# EasyEDA Pro project ProDocument_Upper_ESP32_2024-12-26.epro

# Schematic Upper_ESP32
Create Date: 2024-12-10; Page Name: P1; Project Name: Kame Quadrapot; Schematic Name: Upper_ESP32; Update Date: 2024-12-20; Company: Personal; Drawn: San Thit Aung; Page Size: A3; Part Number: PCB002; Reviewed: San Thit Aung; Version: V0.1
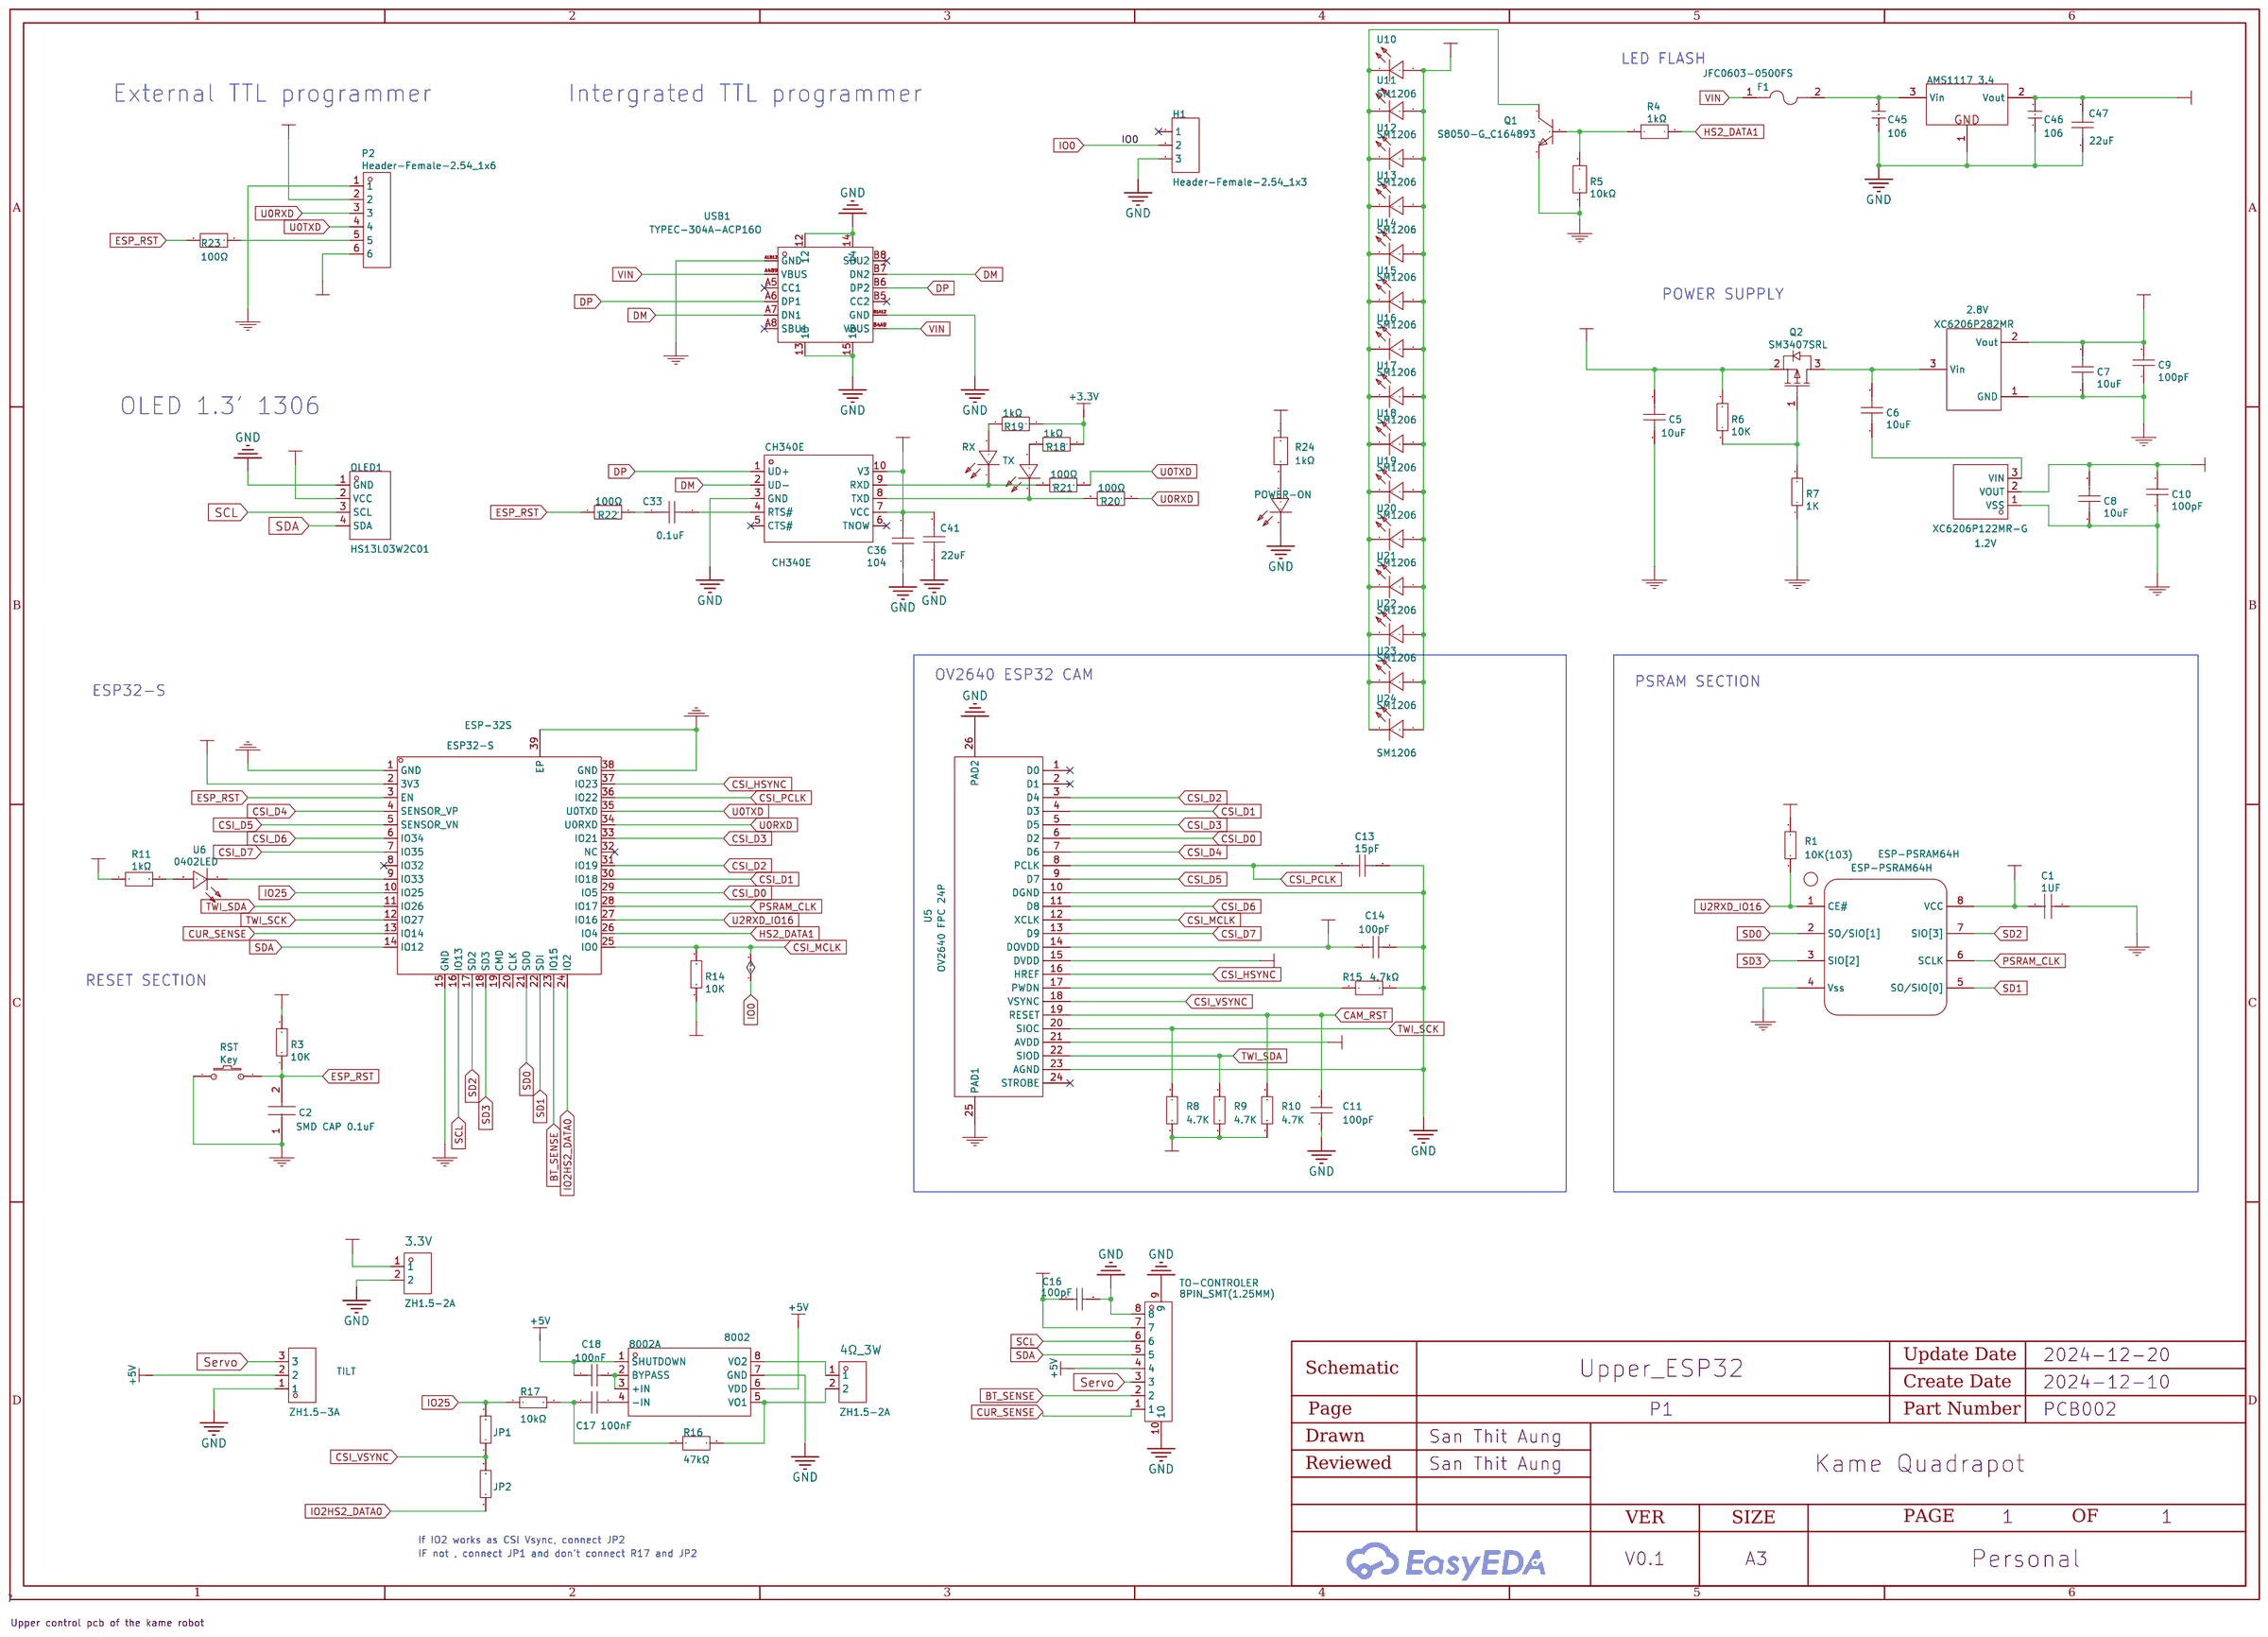
[diagram p0: schematic sheet]

## Parts
1.2V  XC6206P122MR-G  [SOT-23-3_L2.9-W1.6-P1.90-LS2.8-BR]
2.8V  XC6206P282MR  [SOT-23-3_L2.9-W1.6-P1.90-LS2.8-BR]
3.3V  ZH1.5-2A  [CONN-TH_ZH-1.5-2A]
4Ω_3W  ZH1.5-2A  [CONN-TH_ZH-1.5-2A]
8002A  8002  [SOP-8_L4.9-W3.9-P1.27-LS6.0-BL]
AMS1117 3.4  AMS1117-3.3  [TO-252-3_L6.6-W6.1-P4.58-LS10.1-BR]
C1  1UF  [0402]
C2  SMD CAP 0.1uF  [CAPC2012X94N]
C5  10uF  [C0805]
C6  10uF  [C0805]
C7  10uF  [C0805]
C8  10uF  [C0805]
C9  100pF  [C0402]
C10  100pF  [C0402]
C11  100pF  [C0402]
C13  15pF  [C0402]
C14  100pF  [C0402]
C16  100pF  [C0402]
C17  100nF  [C0603]
C18  100nF  [C0603]
C33  0.1uF  [C0603]
C36  104  [C0603]
C41  22uF  [C1206]
C45  106  [C0805]
C46  106  [C0805]
C47  22uF  [C1206]
CH340E  CH340E  [MSOP-10_L3.0-W3.0-P0.50-LS5.0-BL]
ESP-32S  ESP32-S  [WIRELM-SMD_ESP32-S-NO_CMD_CLK]
ESP-PSRAM64H  ESP-PSRAM64H  [SOP8_150MIL_JX]
F1  JFC0603-0500FS  [F0603]
H1  Header-Female-2.54_1x3  [HDR-3X1/2.54]
JP1  10kΩ  [R0603]
JP2  10kΩ  [R0603]
OLED1  HS13L03W2C01  [1.3'' 4pin oled SH1106]
P2  Header-Female-2.54_1x6  [HDR-TH_6P-P2.54-V-F]
POWER-ON  Green  [LED0603-RD_GREEN]
Q1  S8050-G_C164893  [SOT-23-3_L2.9-W1.3-P1.90-LS2.4-BR]
Q2  SM3407SRL  [SOT-23-3_L2.9-W1.3-P1.90-LS2.4-BR]
R1  10K(103)  [0603]
R3  10K  [0201]
R4  1kΩ  [R0402]
R5  10kΩ  [R0402]
R6  10K  [R0402]
R7  1K  [R0603]
R8  4.7K  [R0402]
R9  4.7K  [R0402]
R10  4.7K  [R0402]
R11  1kΩ  [R0402]
R14  10K  [R0402]
R15  4.7kΩ  [R0402]
R16  47kΩ  [R0603]
R17  10kΩ  [R0603]
R18  1kΩ  [R0603]
R19  1kΩ  [R0603]
R20  100Ω  [R0603]
R21  100Ω  [R0603]
R22  100Ω  [R0603]
R23  100Ω  [R0603]
R24  1kΩ  [R0603]
RST  Key  [KEY]
RX  Green  [LED0603-RD_GREEN]
TILT  ZH1.5-3A  [CONN-TH_ZH1.5-3A_C2829733]
TO-CONTROLER  8PIN_SMT(1.25MM)  [CONN-SMD_8PIN_SMT-P1.25]
TX  LedGreen_0603  [LED0603-RD_GREEN]
U5  OV2640 FPC 24P  [OV2640 FPC 24P]
U6  0402LED  [LED0402-RD]
U10  SM1206  [LED1206-RD]
U11  SM1206  [LED1206-RD]
U12  SM1206  [LED1206-RD]
U13  SM1206  [LED1206-RD]
U14  SM1206  [LED1206-RD]
U15  SM1206  [LED1206-RD]
U16  SM1206  [LED1206-RD]
U17  SM1206  [LED1206-RD]
U18  SM1206  [LED1206-RD]
U19  SM1206  [LED1206-RD]
U20  SM1206  [LED1206-RD]
U21  SM1206  [LED1206-RD]
U22  SM1206  [LED1206-RD]
U23  SM1206  [LED1206-RD]
U24  SM1206  [LED1206-RD]
USB1  TYPEC-304A-ACP16O  [USB-SMD_TYPEC-304A-ACP16O]

## Library data of the parts
1.2V = XC6206P122MR-G: Supplier: LCSC; Supplier Part: C424699; Manufacturer: Torex Semicon; JLCPCB Part Class: Extend; JLCPCB SMD: Yes; SMT Type: Extend; spicePre: U
2.8V = XC6206P282MR: Supplier: LCSC; Manufacturer: TOREX; image: //image.lceda.cn/szlcsc/C14255.jpg; Supplier Part: C14255; JLCPCB Part Class: Extend; JLCPCB SMD: Yes; SMT Type: Extend; spicePre: U
3.3V 4Ω_3W = ZH1.5-2A_C722910: Pins Structure:1x2P Pitch:1.5mm Mounting Style:Straight Reference Series:ZH Number of Pins:2P Number of Rows:1 Number of PINs Per Row:2 Row Spacing:- Current Rating (Max):1A Operating Temperature Range:-25℃~+85℃ Operating Temperature Range:-25℃~+85℃; LCSC Part Name: 1x2P 间距:1.5mm 直插 系列:ZH; Supplier Part: C722910; Manufacturer: CAX(创都); Supplier Footprint: 插件,P=1.5mm; JLCPCB Part Class: Extended Part; Datasheet: https://atta.szlcsc.com/upload/public/pdf/source/20200902/C722910_3A606E9023366FB4B71ACF538A145687.pdf; Supplier: LCSC; Pins Structure: 1x2P; Pitch: 1.5mm; Mounting Style: Straight; Reference Series: ZH; Number of Pins: 2P; Number of Rows: 1; Number of PINs Per Row: 2; Current Rating (Max): 1A; Operating Temperature Range: -25℃~+85℃
8002A = 8002: LCSC Part Name: Aip8002; Supplier Part: C5139016; Manufacturer: I-CORE(中微爱芯); Supplier Footprint: SOP-8; JLCPCB Part Class: Extended Part; Datasheet: https://atta.szlcsc.com/upload/public/pdf/source/20220816/03501F7F7652C9F9E3FDDA0D1837E9DD.pdf; Supplier: LCSC
AMS1117 3.4 = AMS1117-5.0: ------ѹоƬ; BOM____: --ѹоƬ; __Ȩ____: Դ----; ѧϰ__Դ: www.ooocke.com; Origin Footprint 2: SOT223_L; Origin Footprint 3: SOT223_M; Origin Footprint 4: SOT223_N; Origin Footprint 5: SOT89_N; Origin Footprint 6: SOT89_M; Origin Footprint 1: SOT89_L; Design Item ID: AMS1117; Library Name: 1.3   - --Դ--оƬ
C1 = 1UF: Partnumber: CL05A105MP5NNNC; Manufacturer: Samsung Electro-Mechanics; Comment: =Value; spicePre: C
C2 = SMD CAP 0.1uF: spicePre: C
C5-C8 = 10uF: Supplier: LCSC; Manufacturer: FH; Manufacturer Part: 0805F106M160NT; Supplier Part: C90545; JLCPCB Part Class: Extend; JLCPCB SMD: Yes; SMT Type: Extend; spicePre: C
C9-C11 C14 C16 = 100pF: Supplier: LCSC; Manufacturer: FH; Manufacturer Part: 0402CG101J500NT; Supplier Part: C1546; JLCPCB Part Class: Basic; JLCPCB SMD: Yes; SMT Type: Basic; spicePre: C
C13 = 15pF: Supplier: LCSC; Supplier Part: C3903890; Manufacturer: TDK; Manufacturer Part: CGJ2B2C0G1H150J050BA; spicePre: C
C17 C18 = CT41G-0603-2X1-50V-0.1μF-K(N): Capacitance: Tolerance:±10% Tolerance:±10% Voltage Rated: Temperature Coefficient:; LCSC Part Name: 100nF ±10% 50V; Supplier Part: C125205; Manufacturer: TORCH(火炬); Supplier Footprint: 0603; JLCPCB Part Class: Extended Part; Datasheet: https://atta.szlcsc.com/upload/public/pdf/source/20171225/C150708_15141883600121203188.pdf; Supplier: LCSC; Tolerance: ±10%
C33 C36 = 1u: Manufacturer Part: ?
C41 C47 = 22uF: Supplier: LCSC; Supplier Part: C141046; Manufacturer: KEMET; Manufacturer Part: C1210C106M4PAC7800; JLCPCB Part Class: Extended Part
C45 C46 = 106: -޼-----Ƭ----; BOM____: -޼-----Ƭ----; __Ȩ____: Դ----; ѧϰ__Դ: www.ooocke.com; Origin Footprint 2: C 0201_L; Origin Footprint 3: C 0402_L; Origin Footprint 4: C 0603_L; Origin Footprint 5: C 1206_L; Origin Footprint 6: C 1210_L; Origin Footprint 7: C 1808_L; Origin Footprint 8: C 1812_L; Origin Footprint 9: C 1825_L; Origin Footprint 10: C 2225_L; Origin Footprint 11: C 0201_M; Origin Footprint 12: C 0402_M; Origin Footprint 13: C 0603_M; Origin Footprint 14: C 0805_M; Origin Footprint 15: C 1206_M; Origin Footprint 16: C 1210_M; Origin Footprint 17: C 1808_M; Origin Footprint 18: C 1812_M; Origin Footprint 19: C 1825_M; Origin Footprint 20: C 2225_M; Origin Footprint 1: C 0805_L; Design Item ID: C; Library Name: 3.1   - -------------
CH340E = CH340E: Applications Function:Transceiver Protocol: Supply Voltage:3.3V；5V Supply Voltage:3.3V；5V Data Rate:2Mbps; LCSC Part Name: USB转串口芯片CH340; Supplier Part: C99652; Manufacturer: WCH(南京沁恒); Supplier Footprint: MSOP-10; JLCPCB Part Class: Extended Part; Datasheet: https://atta.szlcsc.com/upload/public/pdf/source/20240313/4FD4567B6A986AE079C4960D6CEBDDB5.pdf; Supplier: LCSC; Applications Function: Transceiver; Supply Voltage: 3.3V；5V; Data Rate: 2Mbps
ESP-32S = ESP32-S: Supplier: LCSC; Supplier Part: C277944; Manufacturer: Ai-Thinker; spicePre: U
ESP-PSRAM64H = ESP-PSRAM64H: Manufacturer: Espressif; Manufacturer Part: PSRAM64H; link: https://www.espressif.com/sites/default/files/documentation/esp-psram64_esp-psram64h_datasheet_en.pdf; spicePre: U
F1 = JFC0603-0500FS: Type:SMD Fuse Current Rating:500mA Voltage Rating  (AC):32V Voltage Rating (DC):32V Operating Temperature:-55℃~+125℃ Operating Temperature:-55℃~+125℃ Breaking Capacity:50A; LCSC Part Name: 贴片式保险丝; Supplier Part: C136327; Manufacturer: JDTfuse(集电通); Supplier Footprint: 0603; JLCPCB Part Class: Extended Part; Datasheet: https://atta.szlcsc.com/upload/public/pdf/source/20230515/811EFBDB78EA9425F730277E38B1B60D.pdf; Supplier: LCSC; Type: SMD Fuse; Current Rating: 500mA; Voltage Rating  (AC): 32V; Voltage Rating (DC): 32V; Operating Temperature: -55℃~+125℃; Breaking Capacity: 50A
H1 = Header-Female-2.54_1x3: Supplier Part: C50950; Supplier: LCSC; Manufacturer: BOOMELE; Manufacturer Part: 2.54mm 1*3p Female header
JP1 JP2 R17 = RMC060310KFN: Resistance: Tolerance:±1% Tolerance:±1% Power(Watts):; LCSC Part Name: 10kΩ ±1% 100mW; Supplier Part: C269701; Manufacturer: Tyohm(幸亚电阻); Supplier Footprint: 0603; JLCPCB Part Class: Extended Part; Datasheet: https://atta.szlcsc.com/upload/public/pdf/source/20190115/C325956_D27151D492FFB3C9AB4A6F14FE01F30A.pdf; Supplier: LCSC; Tolerance: ±1%
OLED1 = HS13L03W2C01: Main Control Chip:SH1106 Interface Type:I2C Size:1.3 Operating Temperature:-40℃~+70℃ Operating Temperature:-40℃~+70℃; LCSC Part Name: 1.3'1.3寸 128*64 OLED显示屏 I2C通讯 SH1106 白光; Supplier Part: C7465997; Manufacturer: HS(汉昇); JLCPCB Part Class: Extended Part; Datasheet: https://atta.szlcsc.com/upload/public/pdf/source/20230720/8731A47396DED074CDCD72E9ACEFB46F.pdf; Supplier: LCSC; Main Control Chip: SH1106; Interface Type: I2C; Size: 1.3; Operating Temperature: -40℃~+70℃
P2 = Header-Female-2.54_1x6: Supplier: LCSC; Manufacturer: BOOMELE(博穆精密); Manufacturer Part: 2.54-1*6P母; Supplier Part: C40877; JLCPCB Part Class: Extended Part; spicePre: P
POWER-ON RX TX = LedGreen_0603: Supplier: Mouser
Q1 = S8050-G_C164893: Supplier: LCSC; Supplier Part: C164893; Manufacturer: Changjiang Electronics Tech (CJ); Manufacturer Part: S8050-G; JLCPCB Part Class: Extend; JLCPCB SMD: Yes; SMT Type: Extend; spicePre: Q
Q2 = SM3407SRL: Supplier: LCSC; Supplier Part: C235545; Manufacturer: SPS; JLCPCB Part Class: Extend; JLCPCB SMD: Yes; SMT Type: Extend; spicePre: Q
R1 = 10K(103): Supplier Part: C99198; Supplier: LCSC; Manufacturer: YAGEO; Manufacturer Part: RC0603JR-0710KL; spicePre: R
R3 = 10K: Supplier: Digi-Key; Manufacturer: YAGEO; Manufacturer Part: RC0201JR-0710KL; Supplier Part: 311-10KNCT-ND; sourceId: Yke82kCUc; spicePre: R
R4 R11 = 1kΩ: Supplier: LCSC; Supplier Part: C2961360; Manufacturer: FH(风华); Manufacturer Part: TC02G1001FT; JLCPCB Part Class: Extended Part; spicePre: U
R5 = 10kΩ: Supplier: LCSC; Supplier Part: C5119777; Manufacturer: RALEC(旺诠); Manufacturer Part: RAT021002FTH; JLCPCB Part Class: Extended Part; spicePre: U
R6 R14 = 10K: Supplier: LCSC; Manufacturer: UniOhm; Manufacturer Part: 0402WGF1002TCE; Supplier Part: C25744; JLCPCB Part Class: Basic; JLCPCB SMD: Yes; SMT Type: Basic; spicePre: R
R7 = 1K: Supplier: LCSC; Manufacturer: UniOhm; Manufacturer Part: 0603WAF1001T5E; Supplier Part: C21190; JLCPCB Part Class: Basic; JLCPCB SMD: Yes; SMT Type: Basic; spicePre: R
R8-R10 = 4.7K: Supplier: LCSC; Manufacturer: UniOhm; Manufacturer Part: 0402WGF4701TCE; Supplier Part: C25900; JLCPCB Part Class: Basic; JLCPCB SMD: Yes; SMT Type: Basic; spicePre: R
R15 = 4.7kΩ: Supplier: LCSC; Supplier Part: C2906941; Manufacturer: FOJAN(富捷); Manufacturer Part: FRC0402J472 TS; JLCPCB Part Class: Extended Part; spicePre: U
R16 R18-R24 = SCR0603F8R06: Type:Thick Film Resistors Resistance: Tolerance:±1% Tolerance:±1% Power(Watts): Overload Voltage (Max): Operating Temperature Range:-55℃~+155℃ Operating Temperature Range:-55℃~+155℃; LCSC Part Name: 厚膜电阻 8.06Ω ±1% 100mW; Supplier Part: C3016465; Manufacturer: VO(翔胜); Supplier Footprint: 0603; JLCPCB Part Class: Extended Part; Datasheet: https://atta.szlcsc.com/upload/public/pdf/source/20220513/247AF9639BA21CF93567DC289CCC6A22.pdf; Supplier: LCSC; Type: Thick Film Resistors; Tolerance: ±1%; Operating Temperature Range: -55℃~+155℃
RST = Key: spicePre: U
TILT = ZH1.5-3A: Pins Structure:1x3P Pitch:1.5mm Mounting Style:Direct Insert Reference Series:ZH Number of Pins:3P Number of Rows:1 Number of PINs Per Row:3 Current Rating (Max):1A Contact Material:Brass Contact Plating:Tin Operating Temperature Range:-25℃~+85℃ Operating; LCSC Part Name: 1x3P 间距:1.5mm 直插 系列:ZH; Supplier Part: C2829733; Manufacturer: FG(富港); Supplier Footprint: 插件,P=1.5mm; JLCPCB Part Class: Extended Part; Datasheet: https://atta.szlcsc.com/upload/public/pdf/source/20210425/C2829732_F26530E371F6662D5811C22FF273BDDC.pdf; Supplier: LCSC; Pins Structure: 1x3P; Pitch: 1.5mm; Mounting Style: Direct Insert; Reference Series: ZH; Number of Pins: 3P; Number of Rows: 1; Number of PINs Per Row: 3; Current Rating (Max): 1A; Contact Material: Brass; Contact Plating: Tin; Operating Temperature Range: -25℃~+85℃; Rated Voltage (Max): 100V
TO-CONTROLER = 8PIN_SMT(1.25MM): Supplier Part: C9900003224; Supplier Footprint: CON-SMD-8PIN-P1.25mm; JLCPCB Part Class: Extended Part; Supplier: LCSC
U5 = OV2640 FPC 24P: Supplier: LCSC; spicePre: U
U6 = 0402LED: Supplier: LCSC; Supplier Part: C9900023982; Manufacturer: null; JLCPCB Part Class: Extended Part; spicePre: U
U10-U24 = SM1206: Supplier Part: C9900019107; Supplier Footprint: LED-SMD1206; JLCPCB Part Class: Extended Part; Supplier: LCSC
USB1 = TYPEC-304A-ACP16O: Supplier: LCSC; Supplier Part: C2909610; Manufacturer: XUNPU(讯普); JLCPCB Part Class: Extended Part

## Nets
+3.3V: 3.3V.1 AMS1117 3.4.2(Vout) C1.1 C5.2 C14.1 C16.1 C36.2 C41.2 C46.2 C47.2 CH340E.7(VCC) CH340E.10(V3) ESP-32S.2(3V3) ESP-PSRAM64H.8(VCC) OLED1.2(VCC) P2.6 Q2.2(S) R1.2 R3.2 R6.2 R8.1 R9.1 R10.1 R11.1 R14.1 R18.1 R19.1 R24.1 TO-CONTROLER.7 U5.14(DOVDD) U10.2(+) U11.2(+) U12.2(+) U13.2(+) U14.2(+) U15.2(+) U16.2(+) U17.2(+) U18.2(+) U19.2(+) U20.2(+) U21.2(+) U22.2(+) U23.2(+) U24.2(+)
+5V: 8002A.1(SHUTDOWN) 8002A.6(VDD) C18.1 P2.2 TILT.2 TO-CONTROLER.4
GND: 1.2V.1(VSS) 2.8V.1(GND) 3.3V.2 8002A.7(GND) AMS1117 3.4.1(GND) C1.2 C2.1 C5.1 C7.1 C8.1 C9.1 C10.1 C11.1 C13.2 C14.2 C16.2 C36.1 C41.1 C45.1 C46.1 C47.1 CH340E.3(GND) ESP-32S.1(GND) ESP-32S.15(GND) ESP-32S.38(GND) ESP-32S.39(EP) ESP-PSRAM64H.4(Vss) H1.3 OLED1.1(GND) P2.1 POWER-ON.1(K) Q1.2(E) R5.1 R7.1 R15.2 RST.1 TILT.1 TO-CONTROLER.8 TO-CONTROLER.9 TO-CONTROLER.10 U5.10(DGND) U5.23(AGND) U5.25(PAD1) U5.26(PAD2) USB1.12 USB1.13 USB1.14 USB1.15 USB1.A1B12(GND) USB1.B1A12(GND)
VIN: F1.1 USB1.A4B9(VBUS) USB1.B4A9(VBUS)
BT_SENSE: ESP-32S.23(IO15) TO-CONTROLER.2
CAM_RST: C11.2 R10.2 U5.19(RESET)
CSI_1.2V: 1.2V.2(VOUT) C8.2 C10.2 U5.15(DVDD)
CSI_2.8V: 2.8V.2(Vout) C7.2 C9.2 U5.21(AVDD)
CSI_D0: ESP-32S.29(IO5) U5.6(D2)
CSI_D1: ESP-32S.30(IO18) U5.4(D3)
CSI_D2: ESP-32S.31(IO19) U5.3(D4)
CSI_D3: ESP-32S.33(IO21) U5.5(D5)
CSI_D4: ESP-32S.4(SENSOR_VP) U5.7(D6)
CSI_D5: ESP-32S.5(SENSOR_VN) U5.9(D7)
CSI_D6: ESP-32S.6(IO34) U5.11(D8)
CSI_D7: ESP-32S.7(IO35) U5.13(D9)
CSI_HSYNC: ESP-32S.37(IO23) U5.16(HREF)
CSI_MCLK: ESP-32S.25(IO0) H1.2 R14.2 U5.12(XCLK)
CSI_PCLK: C13.1 ESP-32S.36(IO22) U5.8(PCLK)
CSI_VSYNC: JP1.1 JP2.2 U5.18(VSYNC)
CUR_SENSE: ESP-32S.13(IO14) TO-CONTROLER.1
DM: CH340E.2(UD-) USB1.A7(DN1) USB1.B7(DN2)
DP: CH340E.1(UD+) USB1.A6(DP1) USB1.B6(DP2)
ESP_RST: C2.2 ESP-32S.3(EN) R3.1 R22.2 R23.2 RST.2
HS2_DATA1: ESP-32S.26(IO4) R4.2
IO2HS2_DATA0: ESP-32S.24(IO2) JP2.1
IO25: ESP-32S.10(IO25) JP1.2 R17.1
PSRAM_CLK: ESP-32S.28(IO17) ESP-PSRAM64H.6(SCLK)
SCL: ESP-32S.16(IO13) OLED1.3(SCL) TO-CONTROLER.6
SD0: ESP-32S.21(SDO) ESP-PSRAM64H.2(SO/SIO[1])
SD1: ESP-32S.22(SDI) ESP-PSRAM64H.5(SO/SIO[0])
SD2: ESP-32S.17(SD2) ESP-PSRAM64H.7(SIO[3])
SD3: ESP-32S.18(SD3) ESP-PSRAM64H.3(SIO[2])
SDA: ESP-32S.14(IO12) OLED1.4(SDA) TO-CONTROLER.5
Servo: TILT.3 TO-CONTROLER.3
TWI_SCK: ESP-32S.12(IO27) R8.2 U5.20(SIOC)
TWI_SDA: ESP-32S.11(IO26) R9.2 U5.22(SIOD)
U0RXD: ESP-32S.34(U0RXD) P2.3 R20.1
U0TXD: ESP-32S.35(U0TXD) P2.4 R21.1
U2RXD_IO16: ESP-32S.27(IO16) ESP-PSRAM64H.1(CE#) R1.1
$1N1366: Q1.1(B) R4.1 R5.2
$1N1371: Q2.1(G) R6.1 R7.2
$1N1376: 1.2V.3(VIN) C6.1
$1N1377: 2.8V.3(Vin) C6.2 Q2.3(D)
$1N1387: R11.2 U6.2(+)
$1N2699: R15.1 U5.17(PWDN)
$1N3848: ESP-32S.9(IO33) U6.1(-)
$1N6631: 8002A.4(-IN) C17.2
$1N6705: 8002A.2(BYPASS) 8002A.3(+IN) C18.2
$1N6802: 4Ω_3W.1 8002A.8(VO2)
$1N6814: 4Ω_3W.2 8002A.5(VO1) R16.2
$1N6899: C17.1 R16.1 R17.2
$1N8468: R19.2 RX.2(A)
$1N8470: R18.2 TX.2(A)
$1N8560: CH340E.8(TXD) R20.2 TX.1(K)
$1N8606: CH340E.9(RXD) R21.2 RX.1(K)
$1N8778: P2.5 R23.1
$1N8842: C33.2 CH340E.4(RTS#)
$1N8845: C33.1 R22.1
$1N9016: POWER-ON.2(A) R24.2
$1N9952: Q1.3(C) U10.1(-) U11.1(-) U12.1(-) U13.1(-) U14.1(-) U15.1(-) U16.1(-) U17.1(-) U18.1(-) U19.1(-) U20.1(-) U21.1(-) U22.1(-) U23.1(-) U24.1(-)
$1N12496: AMS1117 3.4.3(Vin) C45.2 F1.2

Not connected (* = marked no-connect by the designer): CH340E 5(CTS#)* 6(TNOW)*; ESP-32S 8(IO32)* 19(CMD) 20(CLK) 32(NC)*; H1 1*; U5 1(D0)* 2(D1)* 24(STROBE)*; USB1 A5(CC1)* A8(SBU1)* B5(CC2)* B8(SBU2)*

## Notes on the sheet
- LED FLASH
- External TTL programmer
- Intergrated TTL programmer
- POWER SUPPLY
- OLED 1.3' 1306
- OV2640 ESP32 CAM
- PSRAM SECTION
- ESP32-S
- RESET SECTION
- If IO2 works as CSI Vsync, connect JP2
- IF not , connect JP1 and don't connect R17 and JP2

# Board Upper_ESP32
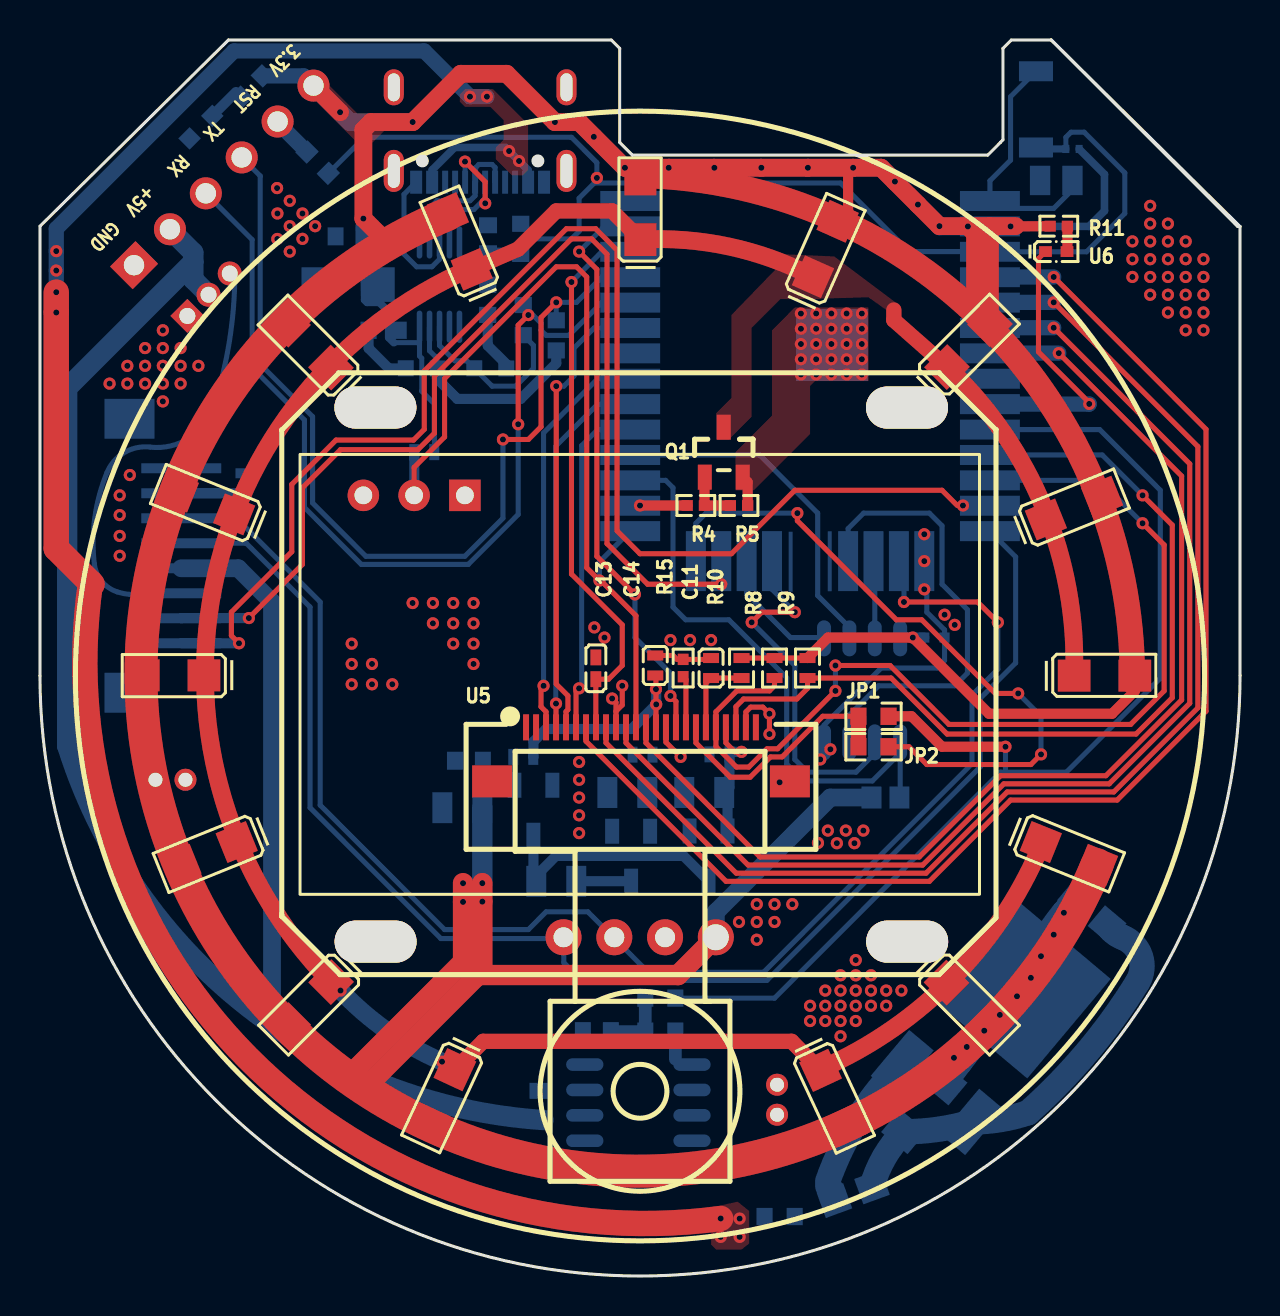
[diagram p1: board, top side]
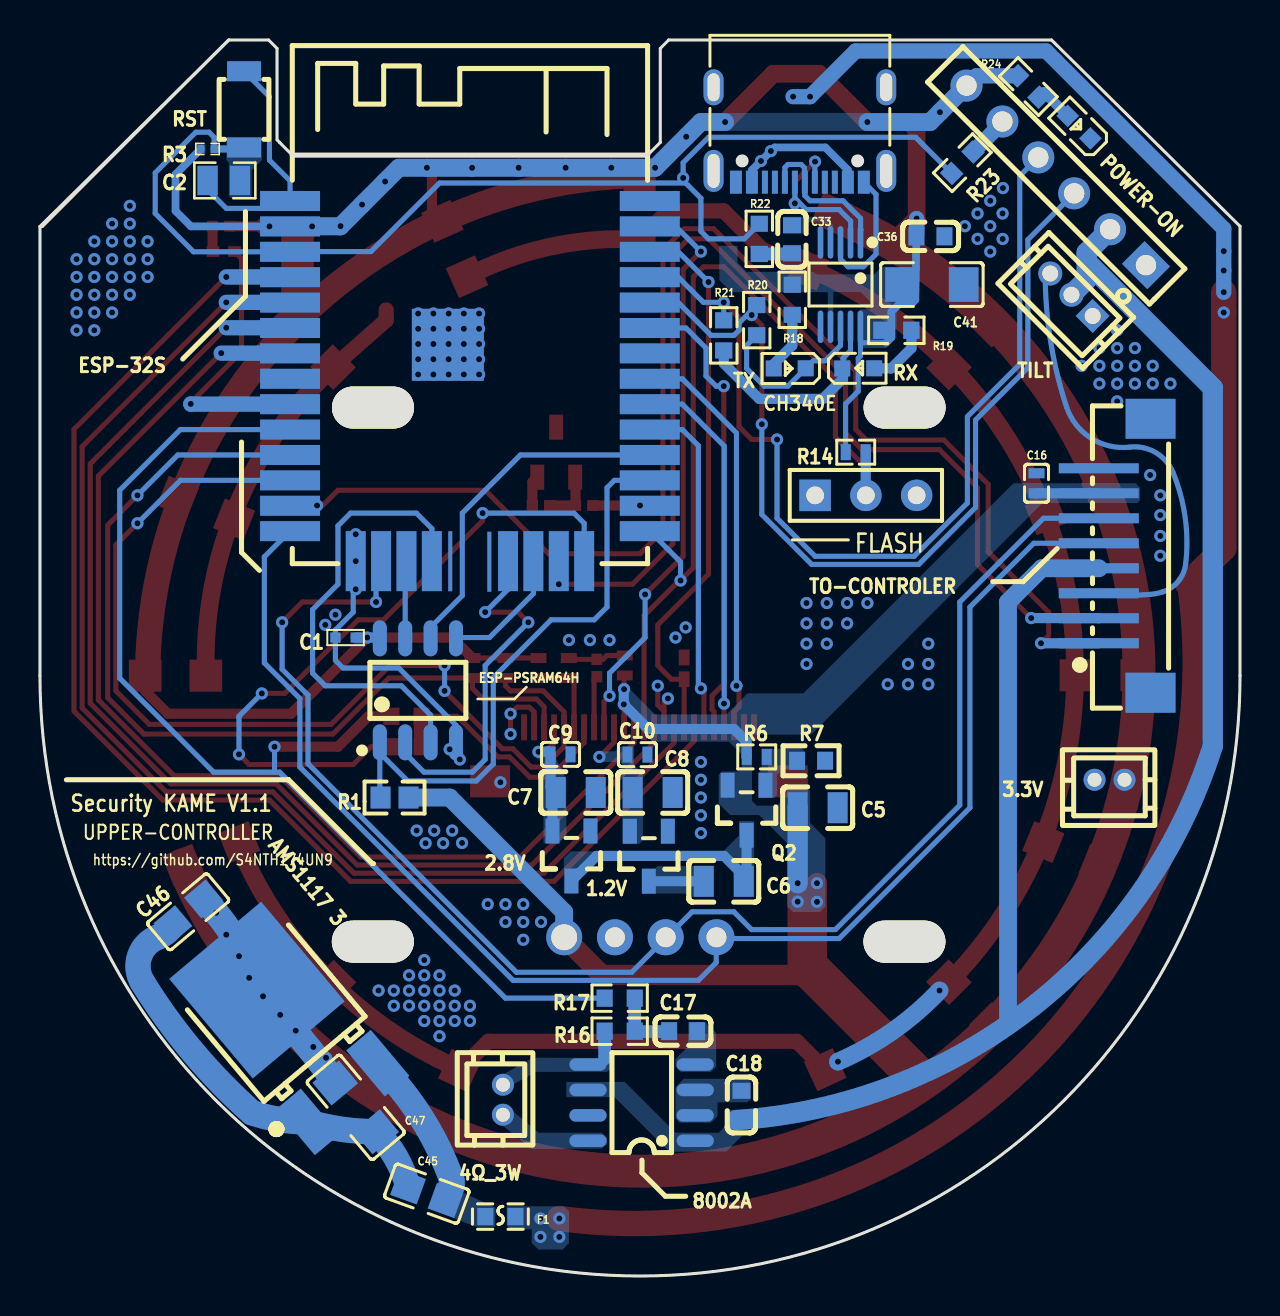
[diagram p2: board, bottom side, seen from below]

Outline 60.05 x 61.81 mm; copper layers: Top Layer, Bottom Layer. Coordinates in mm from the lower left corner of the outline.
Outline path: 50.6,61.81 48.61,61.81 48.19,61.39 48.19,56.82 48.06,56.7 48.06,56.69 47.42,56.06 29.64,56.06 29.01,56.69 29.01,61.39 28.59,61.81 9.43,61.81 0,52.5 0,30.02 arc(30.02,0) 60.05,30.02 60.05,52.49 ; 50.6,61.81 59.93,52.49 60.05,52.49 ; 50.6,61.81 60.05,52.49
Stack: Top Layer 0.035mm / Dielectric1 1.51mm FR4 er 4.5 / Bottom Layer 0.035mm

## Design rules (mm)
template: User Custom Config
spacing safeClearance (default): track to track 0.152, other pairs 0 to 0.152
track width trackWidth (default): min 0.003, default 0.003, max 2.54
differential pair differentialPair (default): width min 0.127, default 0.254, max 2.54; gap min 0.152, default 0.152
via viaSize (default): diameter min 0, default 0, max 2.601; hole min 0, default 0, max 1.999
net GND uses copperRegion1

## Placement (name value [footprint] x y rotation side)
1.2V  XC6206P122MR-G  [SOT-23-3_L2.9-W1.6-P1.90-LS2.8-BR]  29.58 20.99 90 bottom
2.8V  XC6206P282MR  [SOT-23-3_L2.9-W1.6-P1.90-LS2.8-BR]  33.45 21.01 90 bottom
3.3V  ZH1.5-2A  [CONN-TH_ZH-1.5-2A]  6.53 24.82 0 bottom
4Ω_3W  ZH1.5-2A  [CONN-TH_ZH-1.5-2A]  36.88 8.82 90 bottom
8002A  8002  [SOP-8_L4.9-W3.9-P1.27-LS6.0-BL]  29.94 8.67 90 bottom
AMS1117 3.4  AMS1117-3.3  [TO-252-3_L6.6-W6.1-P4.58-LS10.1-BR]  47.04 11.74 230 bottom
C1  1UF  [0402]  44.76 31.93 0 bottom
C2  SMD CAP 0.1uF  [CAPC2012X94N]  50.85 54.79 180 bottom
C5  10uF  [C0805]  21.13 23.42 0 bottom
C6  10uF  [C0805]  25.83 19.74 180 bottom
C7  10uF  [C0805]  33.24 24.18 0 bottom
C8  10uF  [C0805]  29.39 24.18 0 bottom
C9  100pF  [C0402]  34 26.09 0 bottom
C10  100pF  [C0402]  30.15 26.07 0 bottom
C11  100pF  [C0402]  33.58 30.41 270 top
C13  15pF  [C0402#2]  27.81 30.39 90 top
C14  100pF  [C0402]  30.79 30.53 90 top
C16  100pF  [C0402]  10.18 39.65 90 bottom
C17  100nF  [C0603]  27.87 12.24 180 bottom
C18  100nF  [C0603]  24.94 8.56 90 bottom
C33  0.1uF  [C0603]  22.42 51.85 90 bottom
C36  104  [C0603]  15.49 52 0 bottom
C41  22uF  [C1206]  15.42 49.58 0 bottom
C45  106  [C0805#2]  40.69 4.12 200 bottom
C46  106  [C0805#2]  52.63 18.21 140 bottom
C47  22uF  [C1206]  44.25 8.43 50 bottom
CH340E  CH340E  [MSOP-10_L3.0-W3.0-P0.50-LS5.0-BL]  19.99 49.58 0 bottom
ESP-32S  ESP32-S  [WIRELM-SMD_ESP32-S-NO_CMD_CLK]  38.53 44.76 180 bottom
ESP-PSRAM64H  ESP-PSRAM64H  [SOP8_150MIL_JX]  41.14 29.29 180 bottom
F1  JFC0603-0500FS  [F0603]  37.01 2.97 0 bottom
H1  Header-Female-2.54_1x3  [HDR-3X1/2.54]  16.18 39.04 180 bottom
JP1  10kΩ  [R0603]  41.71 27.99 0 top
JP2  10kΩ  [R0603]  41.71 26.47 180 top
OLED1  HS13L03W2C01  [1.3'' 4pin oled SH1106]  30.01 30.09 180 top
P2  Header-Female-2.54_1x6  [HDR-TH_6P-P2.54-V-F]  9.2 55.04 45 bottom
POWER-ON  Green  [LED0603-RD_GREEN]  8.05 57.46 45 bottom
Q1  S8050-G_C164893  [SOT-23-3_L2.9-W1.3-P1.90-LS2.4-BR]  34.22 41.2 270 top
Q2  SM3407SRL  [SOT-23-3_L2.9-W1.3-P1.90-LS2.4-BR]  24.69 23.29 90 bottom
R1  10K(103)  [0603]  43.11 23.93 180 bottom
R3  10K  [0201]  51.67 56.36 0 bottom
R4  1kΩ  [R0402]  32.82 38.53 180 top
R5  10kΩ  [R0402]  34.98 38.53 180 top
R6  10K  [R0402#2]  24.18 25.96 0 bottom
R7  1K  [R0603#2]  21.46 25.77 0 bottom
R8  4.7K  [R0402#2]  36.76 30.41 270 top
R9  4.7K  [R0402#2]  38.41 30.41 270 top
R10  4.7K  [R0402#2]  35.1 30.41 270 top
R11  1kΩ  [R0402]  50.98 52.5 0 top
R14  10K  [R0402#2]  19.23 41.2 180 bottom
R15  4.7kΩ  [R0402]  32.18 30.41 90 top
R16  47kΩ  [R0603]  31.04 12.24 0 bottom
R17  10kΩ  [R0603]  31.04 13.9 180 bottom
R18  1kΩ  [R0603]  22.4 48.82 270 bottom
R19  1kΩ  [R0603]  17.2 47.3 180 bottom
R20  100Ω  [R0603]  24.18 47.8 270 bottom
R21  100Ω  [R0603]  25.83 47.04 270 bottom
R22  100Ω  [R0603]  24.06 51.87 90 bottom
R23  100Ω  [R0603]  13.9 55.68 315 bottom
R24  1kΩ  [R0603]  10.59 59.49 225 bottom
RST  Key  [KEY]  49.84 58.35 270 bottom
RX  Green  [LED0603-RD_GREEN]  19.1 45.39 180 bottom
TILT  ZH1.5-3A  [CONN-TH_ZH1.5-3A_C2829733]  8.43 49.07 45 bottom
TO-CONTROLER  8PIN_SMT(1.25MM)  [CONN-SMD_8PIN_SMT-P1.25]  5.77 36.02 90 bottom
TX  LedGreen_0603  [LED0603-RD_GREEN]  22.53 45.39 0 bottom
U5  -  [OV2640 FPC 24P]  30.02 27.74 0 top
U6  0402LED  [LED0402-RD]  50.85 51.23 0 top
U10  SM1206  [LED1206-RD]  30.04 53.35 90 top
U11  SM1206  [LED1206-RD]  53.27 30.02 0 top
U12  SM1206  [LED1206-RD]  6.69 30.04 180 top
U13  SM1206  [LED1206-RD]  39.7 8.91 295 top
U14  SM1206  [LED1206-RD]  46.46 46.53 45 top
U15  SM1206  [LED1206-RD]  13.49 13.62 225 top
U16  SM1206  [LED1206-RD]  46.44 13.6 315 top
U17  SM1206  [LED1206-RD]  13.49 46.5 135 top
U18  SM1206  [LED1206-RD]  20.12 8.94 245 top
U19  SM1206  [LED1206-RD]  8.43 21.13 202 top
U20  SM1206  [LED1206-RD]  51.49 21.13 338 top
U21  SM1206  [LED1206-RD]  21.01 51.74 113 top
U22  SM1206  [LED1206-RD]  8.31 38.66 158 top
U23  SM1206  [LED1206-RD]  51.74 38.41 22 top
U24  SM1206  [LED1206-RD]  39.3 51.36 66 top
USB1  TYPEC-304A-ACP16O  [USB-SMD_TYPEC-304A-ACP16O]  22.02 57.08 0 bottom

## Footprints (pads in the part's own frame, mm; a bottom-side part is the same pattern mirrored in y, then rotated)
1.3'' 4pin oled SH1106
  oval 4.1x2.1 hole 4.1x2.1: 0(-13.381,13.365) 0(-13.373,-13.345) 0(13.219,13.365) 0(13.227,-13.345)
  round 1.8 hole 1: 1(-1.266,13.147) 3(1.274,13.147) 4(3.814,13.147)
  round 1.8 hole 1.3x1: 2(-3.806,13.147)
0201
  rect 0.35x0.406 smd: 1(-0.33,0) 2(0.33,0)
0402
  rect 0.508x0.508 smd: 1(-0.508,0) 2(0.508,0)
0603
  rect 1x1.1 smd: 1(0.1,0) 2(1.5,0)
C0402
  rect 0.5x0.8 smd: 1(-0.5,0) 2(0.5,0)
C0402#2
  rect 0.79x0.54 smd: 1(-0.545,0) 2(0.545,0)
C0603
  rect 0.8x0.9 smd: 1(-0.7,0) 2(0.7,0)
C0805
  rect 1x1.55 smd: 1(-1,0) 2(1,0)
C0805#2
  rect 1.41x1.35 smd: 1(-1,0) 2(1,0)
C1206
  rect 1.485x1.728 smd: 1(-1.593,0) 2(1.593,0)
CAPC2012X94N
  rect 1.02x1.47 smd: 1(-0.81,0) 2(0.81,0)
CONN-SMD_8PIN_SMT-P1.25
  rect 0.5x4 smd: 1(-4.375,1.295) 2(-3.125,1.295) 3(-1.875,1.295) 4(-0.625,1.295) 5(0.625,1.295) 6(1.875,1.295) 7(3.125,1.295) 8(4.375,1.295)
  rect 2x2.5 smd: 9(6.85,-1.295) 10(-6.85,-1.295)
CONN-TH_ZH1.5-3A_C2829733
  rect 1.2x1.2 hole 0.8: 1(-1.5,0)
  round 1.2 hole 0.8: 2(0,0) 3(1.5,0)
CONN-TH_ZH-1.5-2A
  round 1.1 hole 0.7: 1(-0.75,0) 2(0.75,0)
F0603
  rect 0.806x0.864 smd: 1(-0.753,0) 2(0.753,0)
HDR-3X1/2.54
  rect 1.575x1.575 hole 0.889: 1(-5.08,0)
  round 1.575 hole 0.889: 2(-2.54,0) 3(0,0)
HDR-TH_6P-P2.54-V-F
  rect 1.8x1.6 hole 1.02: 1(-6.35,0)
  round 1.6 hole 1.02: 2(-3.81,0) 3(-1.27,0) 4(1.27,0) 5(3.81,0) 6(6.35,0)
KEY
  rect 1.001x1.7 smd: 1(-1.905,0) 2(1.905,0)
LED0402-RD
  rect 0.636x0.54 smd: 1(-0.538,0) 2(0.538,0)
LED0603-RD_GREEN
  rect 0.8x0.8 smd: 1(-0.799,-0.004) 2(0.799,0.004)
LED1206-RD
  rect 1.635x1.6 smd: 1(-1.518,0) 2(1.518,0)
MSOP-10_L3.0-W3.0-P0.50-LS5.0-BL
  oval 0.28x1.62 smd: 1(-1,-2.11) 2(-0.5,-2.11) 3(0,-2.11) 4(0.5,-2.11) 5(1,-2.11) 6(1,2.11) 7(0.5,2.11) 8(0,2.11) 9(-0.5,2.11) 10(-1,2.11)
OV2640 FPC 24P
  rect 0.3x1.3 smd: 1(-5.702,-0.298) 2(-5.202,-0.298) 3(-4.702,-0.298) 4(-4.202,-0.298) 5(-3.702,-0.298) 6(-3.202,-0.298) 7(-2.702,-0.298) 8(-2.202,-0.298) 9(-1.702,-0.298) 10(-1.202,-0.298) 11(-0.702,-0.298) 12(-0.202,-0.298) 13(0.298,-0.298) 14(0.798,-0.298) 15(1.298,-0.298) 16(1.798,-0.298) 17(2.298,-0.298) 18(2.798,-0.298) 19(3.298,-0.298) 20(3.798,-0.298) 21(4.298,-0.298) 22(4.798,-0.298) 23(5.298,-0.298) 24(5.798,-0.298)
  rect 2x1.6 smd: 25(-7.4,-3) 26(7.5,-3)
R0402
  rect 0.566x0.54 smd: 1(-0.433,0) 2(0.433,0)
R0402#2
  rect 0.5x0.8 smd: 1(-0.5,0) 2(0.5,0)
R0603
  rect 0.806x0.864 smd: 1(-0.753,0) 2(0.753,0)
R0603#2
  rect 0.8x0.9 smd: 1(-0.7,0) 2(0.7,0)
SOP8_150MIL_JX
  oval 0.7x1.8 smd: 1(-1.905,-2.601) 2(-0.635,-2.601) 3(0.635,-2.601) 4(1.905,-2.601) 5(1.905,2.601) 6(0.635,2.601) 7(-0.635,2.601) 8(-1.905,2.601)
SOP-8_L4.9-W3.9-P1.27-LS6.0-BL
  oval 0.63x1.865 smd: 1(-1.905,-2.683) 2(-0.635,-2.683) 3(0.635,-2.683) 4(1.905,-2.683) 5(1.905,2.683) 6(0.635,2.683) 7(-0.635,2.683) 8(-1.905,2.683)
SOT-23-3_L2.9-W1.3-P1.90-LS2.4-BR
  rect 1.25x0.7 smd: 1(1.25,-0.95) 2(1.25,0.95) 3(-1.25,0)
SOT-23-3_L2.9-W1.6-P1.90-LS2.8-BR
  rect 1.25x0.7 smd: 1(1.25,-0.95) 2(1.25,0.95) 3(-1.25,0)
TO-252-3_L6.6-W6.1-P4.58-LS10.1-BR
  rect 3x1.6 smd: 1(3.342,-2.285) 3(3.342,2.285)
  rect 6.5x6 smd: 2(-3.343,0)
USB-SMD_TYPEC-304A-ACP16O
  oval 1x2.1 hole 0.6x1.7: 12(-4.32,1.808) 13(4.32,1.808)
  oval 1x1.8 hole 0.6x1.4: 14(-4.32,-2.373) 15(4.32,-2.373)
  rect 0.6x1.15 smd: A1B12(-3.2,2.373) A4B9(-2.4,2.373) B1A12(3.2,2.373) B4A9(2.4,2.373)
  rect 0.3x1.15 smd: A5(-1.25,2.373) A6(-0.25,2.373) A7(0.25,2.373) A8(1.25,2.373) B5(1.75,2.373) B6(0.75,2.373) B7(-0.75,2.373) B8(-1.75,2.373)
WIRELM-SMD_ESP32-S-NO_CMD_CLK
  rect 3x1 smd: 1(-9,9.005) 2(-9,7.735) 3(-9,6.465) 4(-9,5.195) 5(-9,3.925) 6(-9,2.655) 7(-9,1.385) 8(-9,0.115) 9(-9,-1.155) 10(-9,-2.425) 11(-9,-3.695) 12(-9,-4.965) 13(-9,-6.235) 14(-9,-7.505) 25(9,-7.505) 26(9,-6.235) 27(9,-4.965) 28(9,-3.695) 29(9,-2.425) 30(9,-1.155) 31(9,0.115) 32(9,1.385) 33(9,2.655) 34(9,3.925) 35(9,5.195) 36(9,6.465) 37(9,7.735) 38(9,9.005)
  rect 1x3 smd: 15(-5.715,-9.005) 16(-4.445,-9.005) 17(-3.175,-9.005) 18(-1.905,-9.005) 21(1.905,-9.005) 22(3.175,-9.005) 23(4.445,-9.005) 24(5.715,-9.005)
  rect 0.2x3 smd: 19(-0.985,-9.01) 20(0.97,-9.035)
  rect 3.6x3.6 smd: 39(-1.105,1.815)

## Nets
As in the schematic, except:
SERVO: TILT.3 TO-CONTROLER.3

Pads without a net: CH340E 5 6; ESP-32S 8 19 20 32; H1 1; OLED1 0; U5 1 2 24; USB1 A5 A8 B5 B8

## Via types
v1: diameter 0.61, hole 0.305, Top Layer to Bottom Layer, 238 vias
v2: diameter 0.005, hole 0.005, Top Layer to Bottom Layer, 50 vias

## Routing (per net, layer and track width the routed paths; a pad name or vN(x,y) marks a point on that pad's centre or on a via; arc(x,y) is an arc through that point)
+3.3V: length 355.3
  Top Layer w0.254: R10.1 R8.1 R9.1 ; C14.1 30.82,30 v1(30.82,29.35) U5.14
  Top Layer w0.508: v1(48.57,52.49) R11.1 ; U24.2 40.44,53.27 40.44,55.18 v1(40.69,55.42) ; R9.1 39.43,31.93 v1(43.68,31.93) 47.49,28.12 53.65,28.12 54.78,29.26 U11.2
  Top Layer w0.889: 17.83,51.74 17.32,51.74 v1(16.18,52.88) 16.18,57.33 16.56,57.71 v1(18.65,57.71) 21.06,60.12 23.35,60.12 v1(25.77,57.71) 26.98,57.71 v1(29.27,55.42) v1(31.46,55.42) v1(33.74,55.42) v1(36.1,55.42) v1(38.42,55.42) v1(40.69,55.42) 42.09,55.42 v1(42.78,54.73) v1(43.93,53.58) v1(45.01,52.51) 47.5,52.51 ; U14.2 47.53,52.47 47.5,52.51 ; 13.69,59.53 v1(15.02,58.2) ; v1(46.43,52.49) 46.79,52.14 46.79,48.57 ; 47.5,52.51 48.82,52.51
  Top Layer w1.016: 15.67,10.21 21.17,15.71 v1(21.17,18.71) v1(21.17,19.65) ; v1(22.13,19.65) v1(22.13,18.72) 22.13,15.4 21.78,15.05 ; 21.78,15.05 31.93,15.05 OLED1.2 ; 21.78,15.05 21.78,14.92 16.44,9.58
  Top Layer w1.27: 30.02,55.04 arc(47.52,47.45) 54.66,29.77
  Top Layer w1.651: U20.2 arc(12.34,12.53) 20.38,53.09
  Bottom Layer w0.254: 18.99,46.68 18.99,46.01 19.1,45.9 19.1,44.25 19.74,43.61 19.74,41.21 R14.1 ; 18.99,46.68 CH340E.10 ; 18.99,46.68 17.71,46.68
  Bottom Layer w0.381: 17.71,46.68 17.45,46.93 17.45,48.22 16.98,48.69 16.37,48.69 16.25,48.82 16.19,52 ; R3.2 53.27,55.09 53.27,53.27 52.49,52.49 v1(48.57,52.49)
  Bottom Layer w0.508: v1(30.82,29.35) 30.83,29.34 v1(30.83,28.59) 29.61,27.36 25.33,27.36 24.69,26.72 24.69,25.97 R6.2 ; v1(48.57,52.49) ESP-32S.2 ; C1.1 v1(43.68,31.93) 43.08,31.93 ESP-PSRAM64H.8 ; TO-CONTROLER.7 10.18,39.15 10.18,39.14
  Bottom Layer w0.762: 16.18,52.5 16.18,52.31 ; 16.18,52.5 16.18,52.88 ; 16.18,52.5 16.19,52 ; R24.1 13.2,60.02 13.69,59.53
  Bottom Layer w0.889: OLED1.2 33.82,18.2 39.55,23.93 R1.2 ; v1(18.65,57.71) 15.51,57.71 v1(15.02,58.2) 13.69,59.53 ; ESP-32S.2 v1(46.43,52.49) 45.02,52.49 v1(43.93,53.58) v1(42.78,54.73) 42.09,55.42 v1(40.69,55.42) v1(38.42,55.42) v1(36.1,55.42) v1(33.74,55.42) v1(31.46,55.42) 29.26,55.42 v1(27.71,56.97) 26.98,57.71 v1(25.77,57.71)
  Bottom Layer w1.016: C5.2 v1(22.13,19.65)
  Bottom Layer w1.27: C47.2 arc(45.65,10.17) 46.03,10.69 arc(46.28,11.01) 46.53,11.33 arc(46.91,11.79) 47.29,12.24 arc(47.65,12.66) 48.02,13.07 arc(48.45,13.53) v1(48.89,13.99) arc(49.04,14.14) AMS1117 3.4.2 arc(49.27,14.56) 49.35,14.81 arc(49.6,15.46) 49.88,16.1 arc(50.19,16.66) 50.52,17.21 arc(50.86,17.7) v1(51.23,18.17) arc(51.54,18.52) C46.2
  vias: v1(45.73,10.91) v1(46.37,11.46) v1(47.25,12.27) v1(48.03,13.06) v1(49.58,14.91) v1(50.09,16) v1(50.73,17.07)
+5V: length 89.4
  Bottom Layer w0.889: TO-CONTROLER.4 9.92,35.4 11.61,33.71 11.61,12.63
  Bottom Layer w1.016: 25.2,7.8 arc(10.38,13.46) 1.36,26.51 1.36,44.42 7.67,50.73 ; 7.67,50.73 7.67,51.18 P2.2 ; 7.67,50.73 7.67,49.84 TILT.2
GND: length 65.4
  Top Layer w0.254: v1(29.14,29.52) 29.14,28.56 28.82,28.24 ; v1(28.63,28.88) 28.82,28.69 28.82,28.24 ; C11.1 33.51,30.84 R15.2 31.88,30.84 31.68,31.03 C14.2 ; v1(36.5,27.1) v1(36.5,28.12) 36.17,28.45 35.56,28.45 35.32,28.21 U5.23 ; 28.82,28.24 U5.10
  Top Layer w0.508: R5.1 35.41,39.71 Q1.2
  Bottom Layer w0.254: USB1.A1B12 18.21,54.09 18.21,51.11 18.85,50.47 19.61,50.47 19.99,50.85 CH340E.3 ; v1(44.25,35.75) 44.38,35.62 44.38,33.2 45.26,32.31 C1.2 45.26,30.79 44.88,30.41 42.09,30.41 39.23,27.55 ESP-PSRAM64H.4 ; RST.1 48.57,58.98 48.57,55.81 47.53,54.77 ESP-32S.1 47.9,53.39 50.73,53.39 51.66,54.33 C2.1
  Bottom Layer w1.27: C45.1 arc(42.25,5.94) C47.1 arc(44.95,7.34) AMS1117 3.4.1 arc(48.06,7.82) 49.44,8.17 arc(52.42,11.23) 54.92,14.69 arc(55.06,15.99) 54.15,16.94 arc(53.72,17.2) C46.1
  vias: v1(3.48,44.63) v1(3.99,39.04) v1(3.99,38.05) v1(3.99,37.01) v1(3.99,36.02) v1(4.37,45.52) v1(4.37,44.63) v1(4.5,40.06) v1(5.26,46.41) v1(5.26,45.52) v1(5.26,44.63) v1(6.15,47.3) v1(6.15,46.41) v1(6.15,45.52) v1(6.15,44.63) v1(6.15,43.74) v1(7.04,46.41) v1(7.04,45.52) v1(7.04,44.63) v1(7.93,45.52) v1(11.86,54.41) v1(11.88,53.14) v1(11.88,51.86) v1(12.5,53.77) v1(12.5,52.5) v1(12.5,51.23) v1(13.13,53.14) v1(13.13,51.87) v1(13.77,52.5) v1(15.6,31.62) v1(15.6,30.61) v1(15.6,29.59) v1(16.61,30.61) v1(16.61,29.59) v1(17.63,29.59) v1(18.65,33.66) v1(19.66,33.66) v1(19.66,32.64) v1(20.68,33.66) v1(20.68,32.64) v1(20.68,31.62) v1(21.69,33.66) v1(21.69,32.64) v1(21.69,31.62) v1(21.69,30.61) v1(26.98,25.71) v1(26.98,24.82) v1(26.98,23.93) v1(26.98,23.04) v1(26.98,22.15) v1(27.74,32.44) v1(28.25,31.93) v1(31.55,31.8) v1(32.53,31.8) v1(33.58,31.8) v1(34.98,17.71) v1(35.87,18.59) v1(35.87,17.71) v1(35.87,16.82) v1(36.76,18.59) v1(36.76,17.71) v1(37.01,24.69) v1(37.64,18.59) v1(38.08,48.13) v1(38.08,47.37) v1(38.08,46.61) v1(38.08,45.85) v1(38.08,45.09) v1(38.53,13.51) v1(38.53,12.75) v1(38.84,48.13) v1(38.84,47.37) v1(38.84,46.61) v1(38.84,45.85) v1(38.84,45.09) v1(38.93,21.66) v1(39.04,25.83) v1(39.3,14.28) v1(39.3,13.51) v1(39.3,12.75) v1(39.42,22.28) v1(39.55,26.34) v1(39.6,48.13) v1(39.6,47.37) v1(39.6,46.61) v1(39.6,45.85) v1(39.6,45.09) v1(39.88,21.64) v1(40.06,15.04) v1(40.06,14.28) v1(40.06,13.51) v1(40.06,12.75) v1(40.06,11.99) v1(40.36,48.13) v1(40.36,47.37) v1(40.36,46.61) v1(40.36,45.85) v1(40.36,45.09) v1(40.32,22.28) v1(40.75,21.64) v1(40.82,15.8) v1(40.82,15.04) v1(40.82,14.28) v1(40.82,13.51) v1(40.82,12.75) v1(41.12,48.13) v1(41.12,47.37) v1(41.12,46.61) v1(41.12,45.85) v1(41.12,45.09) v1(41.2,22.28) v1(41.58,15.04) v1(41.58,14.28) v1(41.58,13.51) v1(42.34,14.28) v1(42.34,13.51) v1(43.11,14.28) v1(44.25,37.1) v1(44.25,34.34) v1(45.26,33.07) v1(45.77,32.56) v1(54.66,51.74) v1(54.66,50.85) v1(54.66,49.96) v1(55.55,53.52) v1(55.55,52.63) v1(55.55,51.74) v1(55.55,50.85) v1(55.55,49.96) v1(55.55,49.07) v1(56.44,52.63) v1(56.44,51.74) v1(56.44,50.85) v1(56.44,49.96) v1(56.44,49.07) v1(56.44,48.19) v1(57.33,51.74) v1(57.33,50.85) v1(57.33,49.96) v1(57.33,49.07) v1(57.33,48.19) v1(57.33,47.3) v1(58.22,50.85) v1(58.22,49.96) v1(58.22,49.07) v1(58.22,48.19) v1(58.22,47.3) v2(37.84,48.37) v2(37.84,48.37) v2(37.84,47.61) v2(37.84,47.61) v2(37.84,46.85) v2(37.84,46.85) v2(37.84,46.09) v2(37.84,46.09) v2(37.84,45.32) v2(37.84,45.32) v2(38.6,48.37) v2(38.6,48.37) v2(38.6,47.61) v2(38.6,47.61) v2(38.6,46.85) v2(38.6,46.85) v2(38.6,46.09) v2(38.6,46.09) v2(38.6,45.32) v2(38.6,45.32) v2(39.36,48.37) v2(39.36,48.37) v2(39.36,47.61) v2(39.36,47.61) v2(39.36,46.85) v2(39.36,46.85) v2(39.36,46.09) v2(39.36,46.09) v2(39.36,45.32) v2(39.36,45.32) v2(40.12,48.37) v2(40.12,48.37) v2(40.12,47.61) v2(40.12,47.61) v2(40.12,46.85) v2(40.12,46.85) v2(40.12,46.09) v2(40.12,46.09) v2(40.12,45.32) v2(40.12,45.32) v2(40.89,48.37) v2(40.89,48.37) v2(40.89,47.61) v2(40.89,47.61) v2(40.89,46.85) v2(40.89,46.85) v2(40.89,46.09) v2(40.89,46.09) v2(40.89,45.32) v2(40.89,45.32)
VIN: length 103.5
  Top Layer w1.27: v1(34.06,2.88) arc(10.38,10.93) 2.53,34.68 ; v1(0.81,48.19) v1(0.81,49.2) ; 2.61,34.6 0.81,36.39 0.81,48.2
  Bottom Layer w0.381: USB1.B4A9 24.42,55.31 v1(23.97,55.76) 23.29,56.44 20.75,56.44 19.62,55.31 USB1.A4B9
  Bottom Layer w0.762: v1(0.81,49.2) v1(0.81,50.28) v1(0.81,51.25) 0.81,52.38 9.7,61.27 19.23,61.27 v1(21.52,58.98) v1(22.36,58.98)
  vias: v1(23.47,56.26) v1(34.06,1.96) v1(35.01,2.87) v1(35.01,1.96)
BT_SENSE: length 54.4
  Top Layer w0.254: v1(10.45,32.9) 13.13,35.59 13.13,39.42 15.04,41.33 18.92,41.33 19.74,42.15 19.74,45.01 26.59,51.87 27.6,51.87 28.37,51.1 28.37,36.63 30.41,34.6 v1(34.09,34.6)
  Bottom Layer w0.508: v1(10.45,32.9) 7.08,32.9 TO-CONTROLER.2
CAM_RST: length 4.1
  Top Layer w0.254: R10.2 C11.2 33.32,29.65 U5.19
CSI_1.2V: length 1.8
  Top Layer w0.254: v1(32.06,25.96) 31.32,26.69 U5.15
CSI_2.8V: length 6.4
  Top Layer w0.254: v1(35.1,26.21) 34.77,26.21 34.32,26.66 U5.21
  Bottom Layer w0.508: 2.8V.2 34.4,24.02 C7.2 34.5,24.44 C9.2 34.63,26.21 v1(35.1,26.21)
CSI_D0: length 17
  Top Layer w0.254: v1(26.98,29.39) 26.82,29.24 U5.6
  Bottom Layer w0.254: ESP-32S.29 27.91,42.33 27.1,41.53 27.1,29.52 v1(26.98,29.39)
CSI_D1: length 18.8
  Top Layer w0.254: v1(25.82,28.63) 25.82,27.44
  Bottom Layer w0.254: ESP-32S.30 27.91,43.6 25.81,41.5 25.81,28.53 25.83,28.5
CSI_D2: length 20.3
  Top Layer w0.254: v1(25.2,29.52) 25.07,29.39 25.07,28.47 25.32,28.22 U5.3
  Bottom Layer w0.254: ESP-32S.31 27.91,44.87 25.2,42.16 v1(25.2,29.52)
CSI_D3: length 24.2
  Top Layer w0.254: U5.5 26.32,28.23 26.42,28.32 26.42,29.02 25.83,29.6 v1(25.83,44.5)
  Bottom Layer w0.254: 28.49,47.16 29.28,47.16 ESP-32S.33 27.73,47.41 26.72,46.41 26.72,45.01 26.21,44.5 v1(25.83,44.5)
CSI_D4: length 66.2
  Top Layer w0.254: v1(50.73,49.96) 58.35,42.34 58.35,28.25 53.9,23.8 48.57,23.8 44.5,19.74 34.33,19.74 27.32,26.74 U5.7
  Bottom Layer w0.762: v1(50.73,49.96) 47.55,49.96 47.53,49.95
CSI_D5: length 63
  Top Layer w0.254: U5.9 28.32,26.66 34.84,20.14 44.33,20.14 48.4,24.21 53.73,24.21 57.94,28.41 57.94,41.48 v1(50.73,48.69)
  Bottom Layer w0.762: ESP-32S.5 47.55,48.69 v1(50.73,48.69)
CSI_D6: length 59.7
  Top Layer w0.254: v1(50.73,47.42) 57.53,40.62 57.53,28.64 53.5,24.61 48.23,24.61 44.17,20.55 35.44,20.55 29.32,26.66 U5.11
  Bottom Layer w0.762: ESP-32S.6 47.55,47.42 v1(50.73,47.42)
CSI_D7: length 56.5
  Top Layer w0.254: v1(50.98,46.15) 57.13,40.01 57.13,28.81 53.33,25.02 48.06,25.02 44,20.96 36.03,20.96 30.32,26.66 U5.13
  Bottom Layer w0.762: ESP-32S.7 47.55,46.15 v1(50.98,46.15)
CSI_HSYNC: length 28.6
  Top Layer w0.254: U5.16 31.82,28.73 v1(31.55,29.01) ; v1(26.98,51.23) 27.87,50.34 27.87,35.99 v1(29.77,34.09)
  Bottom Layer w0.254: 29.77,33.83 29.77,31.93 31.55,30.15 v1(31.55,29.01) ; ESP-32S.37 28.23,52.49 v1(26.98,51.23)
CSI_MCLK: length 45
  Top Layer w0.254: H1.2 18.72,40.44 20.25,41.96 20.25,44.88 25.83,50.47 26.85,50.47 27.36,49.96 27.36,35.42 v1(27.99,34.78) 28.06,34.78 29.82,33.02 U5.12
  Bottom Layer w0.254: v1(27.99,34.78) 27.99,35.71 ESP-32S.25
  Bottom Layer w0.508: R14.2 18.73,39.05 H1.2
CSI_PCLK: length 27.8
  Top Layer w0.254: v1(26.6,49.71) 26.6,35.1 29.14,32.56 29.14,30.53 28.45,29.85 C13.1 27.81,27.47
  Bottom Layer w0.254: ESP-32S.36 28.11,51.22 v1(26.6,49.71)
CSI_VSYNC: length 12
  Top Layer w0.254: JP1.1 39.17,27.99 37.14,25.96 36.55,25.96 35.54,24.94 34.54,24.94 32.82,26.66 U5.18
  Top Layer w0.762: JP1.1 40.95,26.91
CUR_SENSE: length 69.1
  Top Layer w0.254: v1(9.96,31.64) 9.58,32.03 9.58,33.2 12.6,36.22 12.6,39.59 14.81,41.81 18.69,41.81 19.23,42.34 19.23,45.26 26.34,52.38 27.8,52.38 28.88,51.3 28.88,37.27 30.02,36.12 34.6,36.12 37.77,39.3 45.14,39.3 45.9,38.53
  Bottom Layer w0.508: TO-CONTROLER.1 v1(9.96,31.64)
  vias: v1(46.18,38.53)
DM: length 8.7
  Top Layer w0.254: v1(21.27,55.73) 22.28,54.72 v1(22.28,53.65)
  Bottom Layer w0.254: USB1.A7 22.27,53.9 21.71,53.33 20.06,53.33 19.48,52.76 19.48,51.7 CH340E.2 ; USB1.B7 21.27,55.72 v1(21.27,55.73)
DP: length 7.1
  Bottom Layer w0.254: 18.98,52.31 18.99,52.32 18.99,52.9 19.86,53.77 21.52,53.77 21.77,54.03 USB1.A6 21.8,54.72 21.8,55.42 21.96,55.59 22.62,55.59 22.77,55.44 USB1.B6
ESP_RST: length 58.4
  Bottom Layer w0.254: v1(27.87,54.92) 27.87,55.68 26.6,56.95 16.23,56.95 R23.2 ; R3.1 51.33,56.95 51.59,57.2 52.25,57.2 54.28,55.17 54.28,53.14 52.36,51.22 ESP-32S.3 47.52,51.23 43.49,51.23 40.06,54.66 27.74,54.66 26.98,53.9 26.98,52.25 26.6,51.87 24.81,51.87 R22.2
  Bottom Layer w0.355: RST.2 49.91,56.36 R3.1
HS2_DATA1: length 2.4
  Top Layer w0.508: 32.39,38.53 v1(30.02,38.53)
IO2HS2_DATA0: length 33.9
  Top Layer w0.254: JP2.1 43.49,26.47 44.38,25.58 49.58,25.58 v1(50.09,26.09) ; v1(48.95,29.14) 47.8,29.14 44.12,32.82 42.85,32.82 37.9,37.77 v1(37.9,38.15)
  Bottom Layer w0.254: ESP-32S.24 32.82,37.64 33.33,38.15 v1(37.9,38.15) ; v1(50.09,26.09) 50.09,27.99 v1(48.95,29.14)
IO25: length 57.9
  Top Layer w0.508: v1(48.31,26.47) 45.14,26.47 43.61,27.99 JP1.2
  Bottom Layer w0.254: 48.31,25.2 51.36,25.2 56.06,29.9 56.06,39.3 53.02,42.33 ESP-32S.10 ; 48.31,25.2 v1(48.31,26.47) ; 48.31,25.2 48.06,25.2 36.76,13.9 32.05,13.9 31.79,13.64
PSRAM_CLK: length 17.5
  Bottom Layer w0.254: ESP-PSRAM64H.6 40.5,32.44 38.91,34.03 38.91,38.15 36.01,41.06 ESP-32S.28
SCL: length 74.9
  Top Layer w0.254: v1(47.93,32.69) 46.92,33.71 v1(43.23,33.71)
  Bottom Layer w0.254: v1(47.93,32.69) 47.93,30.34 46.64,29.05 46.64,25.62 36.21,15.19 30.44,15.19 27.41,18.21 25.33,18.21 24.44,17.32 20.25,17.32 14.02,23.55 14.02,33.71 9.83,37.89 TO-CONTROLER.6 ; ESP-32S.16 43.23,35.5 v1(43.23,33.71)
SD0: length 18.4
  Top Layer w0.254: v1(35.61,32.69) 36.12,33.2 v1(37.77,33.2)
  Bottom Layer w0.254: v1(37.77,33.2) 36.63,34.34 ESP-32S.21 ; ESP-PSRAM64H.2 41.77,26.14 40.83,25.2 38.41,25.2 37.77,25.83 37.77,30.53 v1(35.61,32.69)
SD1: length 6.4
  Bottom Layer w0.254: ESP-PSRAM64H.5 39.19,31.93 37.55,31.93 35.36,34.12 ESP-32S.22
SD2: length 3.9
  Bottom Layer w0.254: ESP-PSRAM64H.7 41.77,35.69 ESP-32S.17
SD3: length 22.9
  Bottom Layer w0.254: ESP-PSRAM64H.3 40.5,28.06 41.96,29.52 45.77,29.52 46.41,30.15 46.41,33.33 45.14,34.6 45.14,37.52 44.5,38.15 41.21,38.15 40.44,37.38 ESP-32S.18
SDA: length 73.1
  Bottom Layer w0.254: ESP-32S.14 48.82,35.96 48.82,30.66 47.04,28.88 47.04,25.45 36.37,14.78 27.1,14.78 26.21,15.68 26.21,16.88 20.06,16.88 13.51,23.42 13.51,33.45 10.32,36.64 TO-CONTROLER.5
SERVO: length 23.6
  Bottom Layer w0.254: 7.32,34.14 arc(5.91,34.05) 4.5,34.09 arc(4.18,34.13) 3.86,34.22 arc(3.09,34.75) 2.72,35.61 arc(2.75,37.94) 3.35,40.18 arc(4.22,41.18) 5.51,41.45 arc(7.46,41.9) 8.69,43.49 arc(9.48,46.77) 9.75,50.13
TWI_SCK: length 50.6
  Top Layer w0.254: v1(39.8,30.53) 42.54,30.53 45.48,27.59 54.58,27.59 56.25,29.26 56.25,36.56 v1(55.17,37.64) ; R8.2 36.76,29.52 36.5,29.26 34.87,29.26 33.82,28.22 U5.20 33.82,26.48 34.85,25.45 35.47,25.45 36.38,26.37 36.91,26.37 v1(39.8,29.26)
  Bottom Layer w0.254: v1(55.17,37.64) 53.02,39.79 ESP-32S.12 ; v1(39.8,30.53) v1(39.8,29.26)
TWI_SDA: length 44.9
  Top Layer w0.254: v1(55.17,39.04) 56.66,37.55 56.66,28.92 54.84,27.1 45.39,27.1 42.59,29.91 R9.2 38.41,29.39 37.87,28.86 35.21,28.86 34.82,28.47 U5.22
  Bottom Layer w0.254: ESP-32S.11 53.15,41.06 v1(55.17,39.04)
U0RXD: length 47.3
  Top Layer w0.254: v1(24.44,48.06) 23.93,47.55 v1(23.93,42.6)
  Bottom Layer w0.254: ESP-32S.34 28.11,48.68 26.47,47.04 25.33,47.04 25.07,47.3 25.07,47.66 24.67,48.06 v1(24.44,48.06) ; P2.3 10.61,51.83 10.61,45.43 13.23,42.81 13.23,38.43 16.08,35.59 21.43,35.59 23.93,38.09 v1(23.93,42.6)
U0TXD: length 47.7
  Top Layer w0.254: v1(23.17,41.84) 24.44,41.84 25.07,42.47 25.07,47.93 v1(25.83,48.69)
  Bottom Layer w0.254: v1(23.17,41.84) 23.17,37.9 21.26,35.99 16.31,35.99 13.64,38.66 13.64,42.98 11.02,45.6 11.02,55.01 10.09,55.94 ; 29.53,49.95 28.11,49.95 26.85,48.69 v1(25.83,48.69) 25.83,48.05
U2RXD_IO16: length 29.1
  Bottom Layer w0.254: 43.04,26.15 43.04,23.97 R1.1 ; 43.04,26.15 ESP-PSRAM64H.1 ; 43.04,26.15 41.65,24.76 38.21,24.76 37.36,25.6 37.36,29.92 34.47,32.82 32.31,32.82 31.68,33.45 31.68,39.42 31.31,39.79 ESP-32S.27
$1N1366: length 2.7
  Top Layer w0.508: Q1.1 33.25,39.94 R4.1 R5.2
$1N1376: length 2.7
  Bottom Layer w0.508: C6.1 26.84,19.74 1.2V.3
$1N1377: length 12.1
  Bottom Layer w0.508: 24.69,19.88 C6.2 ; 24.69,19.88 25.82,21.01 32.2,21.01 2.8V.3 ; 24.69,19.88 Q2.3
$1N1387: length 1.3
  Top Layer w0.508: U6.2 51.41,51.25 R11.2
$1N2699: length 2.6
  Top Layer w0.254: R15.1 32.32,29.83 U5.17
$1N3848: length 13.8
  Top Layer w0.254: v1(52.5,43.61) 52.5,43.68 49.96,46.22 49.96,50.88 U6.1
  Bottom Layer w0.762: v1(52.5,43.61) 52.49,43.6 ESP-32S.9
$1N6814: length 1.1
  Bottom Layer w0.635: 31.79,11.99 31.79,10.85
$1N6899: length 2.7
  Bottom Layer w0.635: 30.29,13.64 30.29,12.22 28.97,12.22
$1N8468: length 3.2
  Bottom Layer w0.508: R19.2 16.44,46.4 17.45,45.39 18.3,45.39 RX.2
$1N8470: length 3.2
  Bottom Layer w0.508: 22.4,48.19 22.4,46.53 23.33,45.61 TX.2
$1N8560: length 8.7
  Bottom Layer w0.254: CH340E.8 19.99,46.54 20.75,45.77 21.35,45.77 TX.1 22.62,44.5 23.8,44.5 24.69,45.39 24.69,46.54 R20.2
$1N8606: length 10.5
  Bottom Layer w0.254: RX.1 19.86,45.43 19.86,45.9 19.49,46.27 CH340E.9
  Bottom Layer w0.508: RX.1 19.86,45.35 19.86,44.88 20.88,43.87 24.06,43.87 25.83,45.65 R21.2
$1N8778: length 2.1
  Bottom Layer w0.762: R23.1 11.89,57.68 11.89,57.74
$1N8845: length 1.6
  Bottom Layer w0.635: R22.1 22.46,51.11
$1N9016: length 1.7
  Bottom Layer w0.508: POWER-ON.2 8.62,58.02 9.81,59.21
$1N9952: length 125.2
  Top Layer w0.762: U10.1 28.63,53.27 25.83,53.27 23.93,51.36 U21.1 ; U13.1 37.61,11.74 22.18,11.74 20.76,10.32 ; 42.72,48.31 42.72,47.8 U14.1
  Top Layer w0.889: U15.1 arc(8.67,34.39) 21.57,50.4 ; U10.1 arc(34.49,51.48) U24.1 ; U14.1 arc(50.23,38.43) U11.1 ; 50.24,21.88 arc(45.78,15) 39.04,10.34
  Bottom Layer w0.889: v1(20.12,10.72) arc(17.4,12.24) v1(15.04,14.28)
$1N12496: length 7.8
  Bottom Layer w1.27: AMS1117 3.4.3 arc(40.95,7.91) 39.42,4.75 ; C45.2 arc(39.67,4.17) 39.42,4.5

## Copper pours and planes (outline as drawn; the poured copper is in the pictures)
+3.3V on Top Layer: 13.64,59.62 17.35,59.62 17.35,56.57 13.64,56.57
+3.3V on Bottom Layer: 5.01,39.68 25.82,39.68 25.82,26.72 5.01,26.72
+3.3V on Bottom Layer: 18.34,58.16 26.21,58.16 26.21,57.27 18.34,57.27
+3.3V on Bottom Layer: 17.2,48.34 19.14,48.34 19.14,46.41 17.2,46.41
+3.3V on Bottom Layer: 20.75,23.42 24.06,23.42 24.06,18.21 20.75,18.21
+3.3V on Bottom Layer: 20.35,51.52 26.06,51.52 26.06,47.42 20.35,47.42
+3.3V on Bottom Layer: 24.43,29.64 30.91,29.64 30.91,25.96 24.43,25.96
+3.3V on Bottom Layer: 16.18,50.47 21.88,50.47 21.88,46.66 16.18,46.66
+3.3V on Bottom Layer: 21.52,26.37 26.09,26.37 26.09,22.53 21.52,22.53
+5V on Bottom Layer: 24.47,9.7 33.71,9.7 33.71,6.22 24.47,6.22
GND on Top Layer: 34.8,48.44 41.45,48.44 41.45,39.3 34.8,39.3
GND on Top Layer: -2.23,65.2 63.04,65.2 63.04,-0.71 -2.23,-0.71
GND on Bottom Layer: -1.47,64.7 62.54,64.7 62.54,-0.71 -1.47,-0.71
VIN on Top Layer: 33.58,3.72 35.49,3.72 35.49,1.32 33.58,1.32
VIN on Top Layer: 21.01,59.36 24.42,59.36 24.42,55.04 21.01,55.04
VIN on Bottom Layer: 33.58,3.48 36.69,3.48 36.69,1.32 33.58,1.32
CSI_1.2V on Bottom Layer: 29.88,26.47 31.96,26.47 31.96,21.61 29.88,21.61
CSI_2.8V on Bottom Layer: 33.71,26.49 35.23,26.49 35.23,21.64 33.71,21.64
ESP_RST on Bottom Layer: 48.95,56.95 50.73,56.95 50.73,53.9 48.95,53.9
$1N1371 on Bottom Layer: 21.77,26.37 24.11,26.37 24.11,23.9 21.77,23.9
$1N1376 on Bottom Layer: 27.23,20.5 29.58,20.5 29.58,18.98 27.23,18.98
$1N1377 on Bottom Layer: 24.31,22.75 33.83,22.75 33.83,18.96 24.31,18.96
$1N6631 on Bottom Layer: 26.21,12.69 28.25,12.69 28.25,10.21 26.21,10.21
$1N6705 on Bottom Layer: 24.49,9.86 28.25,9.86 28.25,7.67 24.49,7.67
$1N6802 on Bottom Layer: 31.68,8.48 37.03,8.48 37.03,6.36 31.68,6.36
$1N6814 on Bottom Layer: 31.48,10.92 37.05,10.92 37.05,9.49 31.48,9.49
$1N8842 on Bottom Layer: 20.36,52.97 22.86,52.97 22.86,51.69 20.36,51.69
$1N9952 on Top Layer: 37.03,51.11 42.98,51.11 42.98,47.8 37.03,47.8
$1N9952 on Top Layer: 33.83,50.98 39.07,50.98 39.07,41.84 33.83,41.84
$1N12496 on Bottom Layer: 37.26,4.5 39.99,4.5 39.99,2.47 37.26,2.47

Small or netless copper shapes (teardrops, artwork), in the pictures only: 1 on Bottom Layer

## Text on the board
Bottom Silkscreen Layer: https://github.com/S4NTH174UN9 | UPPER-CONTROLLER | Security KAME V1.1 | FLASH
Top Silkscreen Layer: GND | +5V | RX | TX | RST | 3.3V
